# EAGLE design Encoder (EAGLE 9.4.2)

## Sheet 1 of 2: tcrt5000
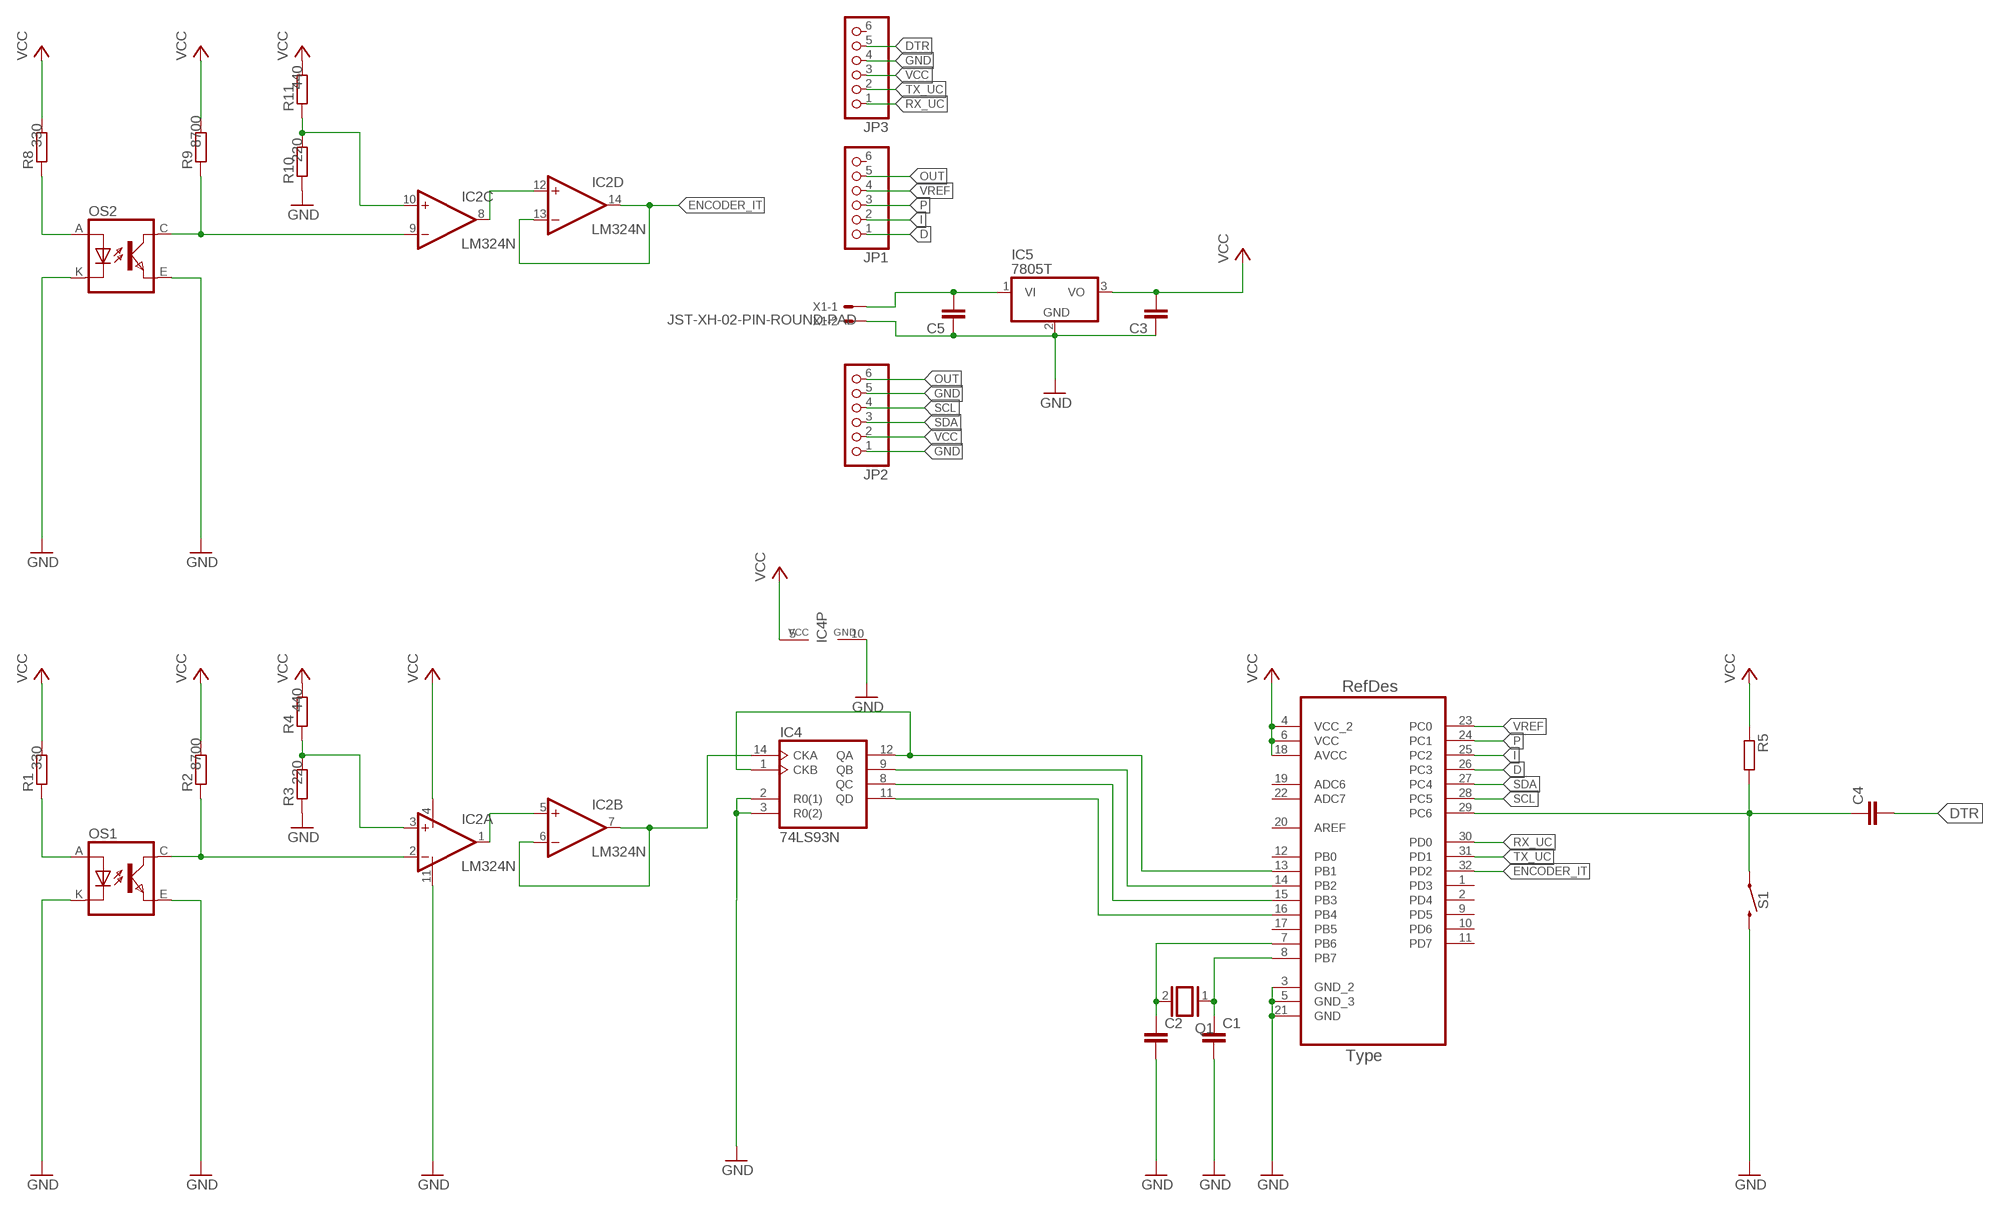
[diagram p0: schematic, sheet 1]

### Parts
C1  C-EUC1206  [C1206]
C2  C-EUC1206  [C1206]
C3  C-EUC1206  [C1206]
C4  C-EUC1206  [C1206]
C5  C-EUC1206  [C1206]
IC2  LM324N  [DIL14]
IC4  74LS93N  [DIL14]
IC5  7805T  [TO220H]
JP1  PINHD-1X6  [1X06]
JP2  PINHD-1X6  [1X06]
JP3  PINHD-1X6  [1X06]
OS1  TCRT5000  [TCRT5000]
OS2  TCRT5000  [TCRT5000]
Q1  XTAL/S  [QS]
R1  R-EU_M1206  [M1206]
R2  R-EU_M1206  [M1206]
R3  R-EU_M1206  [M1206]
R4  R-EU_M1206  [M1206]
R5  R-EU_M1206  [M1206]
R8  R-EU_M1206  [M1206]
R9  R-EU_M1206  [M1206]
R10  R-EU_M1206  [M1206]
R11  R-EU_M1206  [M1206]
S1  MOMENTARY-SWITCH-SPST-PTH-6.0MM  [TACTILE_SWITCH_PTH_6.0MM]
U1  ATMEGA328P-AU  [QFP80P900X900X120-32N]
X1  JST-XH-02-PIN-ROUND-PAD  [JST-XH-02-PACKAGE-ROUND-PAD]

### Nets
D: JP1.1 U1.26(PC3)
DTR: C4.2 JP3.5
ENCODER_IT: IC2.13(D:-IN) IC2.14(D:OUT) U1.32(PD2)
GND: C1.2 C2.2 C3.1 C5.1 IC2.11(P:V-) IC4.2(R0(1)) IC4.3(R0(2)) IC4.10(GND) IC5.2(GND) JP2.1 JP2.5 JP3.4 OS1.E(EMITTER) OS1.K(CATHODE) OS2.E(EMITTER) OS2.K(CATHODE) R3.1 R10.1 S1.3 U1.3(GND_2) U1.5(GND_3) U1.21(GND) X1.2
I: JP1.2 U1.25(PC2)
N$1: OS1.A(ANODE) R1.1
N$2: IC2.2(A:-IN) OS1.C(COLLECTOR) R2.1
N$3: IC2.3(A:+IN) R3.2 R4.1
N$4: IC2.1(A:OUT) IC2.5(B:+IN)
N$5: C1.1 Q1.1 U1.8(PB7)
N$6: C5.2 IC5.1(VI) X1.1
N$7: C2.1 Q1.2 U1.7(PB6)
N$8: C4.1 R5.2 S1.1 U1.29(PC6)
N$9: IC2.6(B:-IN) IC2.7(B:OUT) IC4.14(CKA)
N$10: IC4.1(CKB) IC4.12(QA) U1.13(PB1)
N$11: IC2.8(C:OUT) IC2.12(D:+IN)
N$12: IC4.9(QB) U1.14(PB2)
N$15: OS2.A(ANODE) R8.1
N$16: IC2.9(C:-IN) OS2.C(COLLECTOR) R9.1
N$17: IC2.10(C:+IN) R10.2 R11.1
N$19: IC4.8(QC) U1.15(PB3)
N$20: IC4.11(QD) U1.16(PB4)
OUT: JP1.5 JP2.6
P: JP1.3 U1.24(PC1)
RX_UC: JP3.1 U1.30(PD0)
SCL: JP2.4 U1.28(PC5)
SDA: JP2.3 U1.27(PC4)
TX_UC: JP3.2 U1.31(PD1)
VCC: C3.2 IC2.4(P:V+) IC4.5(VCC) IC5.3(VO) JP2.2 JP3.3 R1.2 R2.2 R4.2 R5.1 R8.2 R9.2 R11.2 U1.4(VCC_2) U1.6(VCC) U1.18(AVCC)
VREF: JP1.4 U1.23(PC0)
Unconnected: JP1.6 JP3.6 U1.1(PD3) U1.2(PD4) U1.9(PD5) U1.10(PD6) U1.11(PD7) U1.12(PB0) U1.17(PB5) U1.19(ADC6) U1.20(AREF) U1.22(ADC7)

## Sheet 2 of 2

## Library data of the parts
C1-C5 = rcl:C-EU: CAPACITOR, European symbol; SPICEPREFIX: C
IC2 = linear:LM324: OP AMP
IC4 = 74xx-eu:74*93: Decade, divide by twelve and binary COUNTER
IC5 = adafruit:78*: Positive VOLTAGE REGULATOR Added bigger pads to the TO-92 package
JP1-JP3 = adafruit:PINHD-1X6: PIN HEADER
OS1 OS2 = tcrt5000:TCRT5000
Q1 = special:XTAL/S: CRYSTAL
R1 R5 R8 = rcl:R-EU_: RESISTOR, European symbol; SPICEPREFIX: 330
R2 R9 = rcl:R-EU_: RESISTOR, European symbol; SPICEPREFIX: 8700
R3 R10 = rcl:R-EU_: RESISTOR, European symbol; SPICEPREFIX: 220
R4 R11 = rcl:R-EU_: RESISTOR, European symbol; SPICEPREFIX: 440
S1 = SparkFun-Switches:MOMENTARY-SWITCH-SPST: Momentary Switch (Pushbutton) - SPST Normally-open (NO) SPST momentary switches (buttons, pushbuttons). Variants PTH-12MM - 12mm square, through-hole Momentary Pushbutton Switch - 12mm Square <https://www.sparkfun.com/products/9190> (COM-09190) PTH-6.0MM, PTH-6.0MM-KIT - 6.0mm square, through-hole Mini Pushbutton Switch <https://www.sparkfun.com/products/97> (COM-00097) KIT package intended for soldering kit's - only one side of pads' copper is exposed. PTH-RIGHT-ANGLE-KIT - Right-angle, through-hole Right Angle Tactile Button <https://www.sparkfun.com/products/10791> - Used on SparkFun BigTime Watch Kit <https://www.sparkfun.com/products/11734> SMD-12MM - 12mm square, surface-mount Tactile Button - SMD (12mm) <https://www.sparkfun.com/products/12993> (COM-12993) Used on SparkFun PicoBoard <https://www.sparkfun.com/products/11888> SMD-4.5MM - 4.5mm Square Trackball Switch Used on SparkFun Blackberry Trackballer Breakout <https://www.sparkfun.com/products/13169> SMD-4.6MMX2.8MM - 4.60mm x 2.80mm, surface mount Used on SparkFun SAMD21 Mini Breakout <https://www.sparkfun.com/products/13664> SMD-5.2MM, SMD-5.2-REDUNDANT - 5.2mm square, surface-mount Mini Pushbutton Switch - SMD <https://www.sparkfun.com/products/8720> (COM-08720) Used on Arduino Pro Mini <https://www.sparkfun.com/products/11114> REDUNDANT package connects both switch circuits together SMD-6.0X3.5MM - 6.0 x 3.5mm, surface mount Momentary Reset Switch SMD <https://www.sparkfun.com/products/8229> (COM-08229) SMD-6.2MM-TALL - 6.2mm square, surface mount Tactile Button - SMD (6mm) <https://www.sparkfun.com/products/12992> Used on SparkFun Digital Sandbox <https://www.sparkfun.com/products/12651> SMD-RIGHT-ANGLE - Right-angle, surface mount Used on SparkFun Block for Intel® Edison - Arduino <https://www.sparkfun.com/products/13036>; PROD_ID: SWCH-08441; SF_SKU: COM-00097
U1 = Atmel-ATMEGA328P-AU:ATMEGA328P-AU; DESCRIPTION: 8-bit Microcontroller with In-System Programmable Flash; MPN: ATMEGA328P-AU; OC_FARNELL: 1715486; OC_NEWARK: 14R4631; PACKAGE: TQFP-32; SUPPLIER: Atmel
X1 = Rembrandt Electronics - JST XH Connectors v1-0:JST-XH-02-PIN: JST XH Connector 2 Pin Wire to board connector. Pitch: 2,54 mm, (0.100") Number of pins: 2 Created by Rembrandt Electronics www.rembrandtelectronics.com

## Board
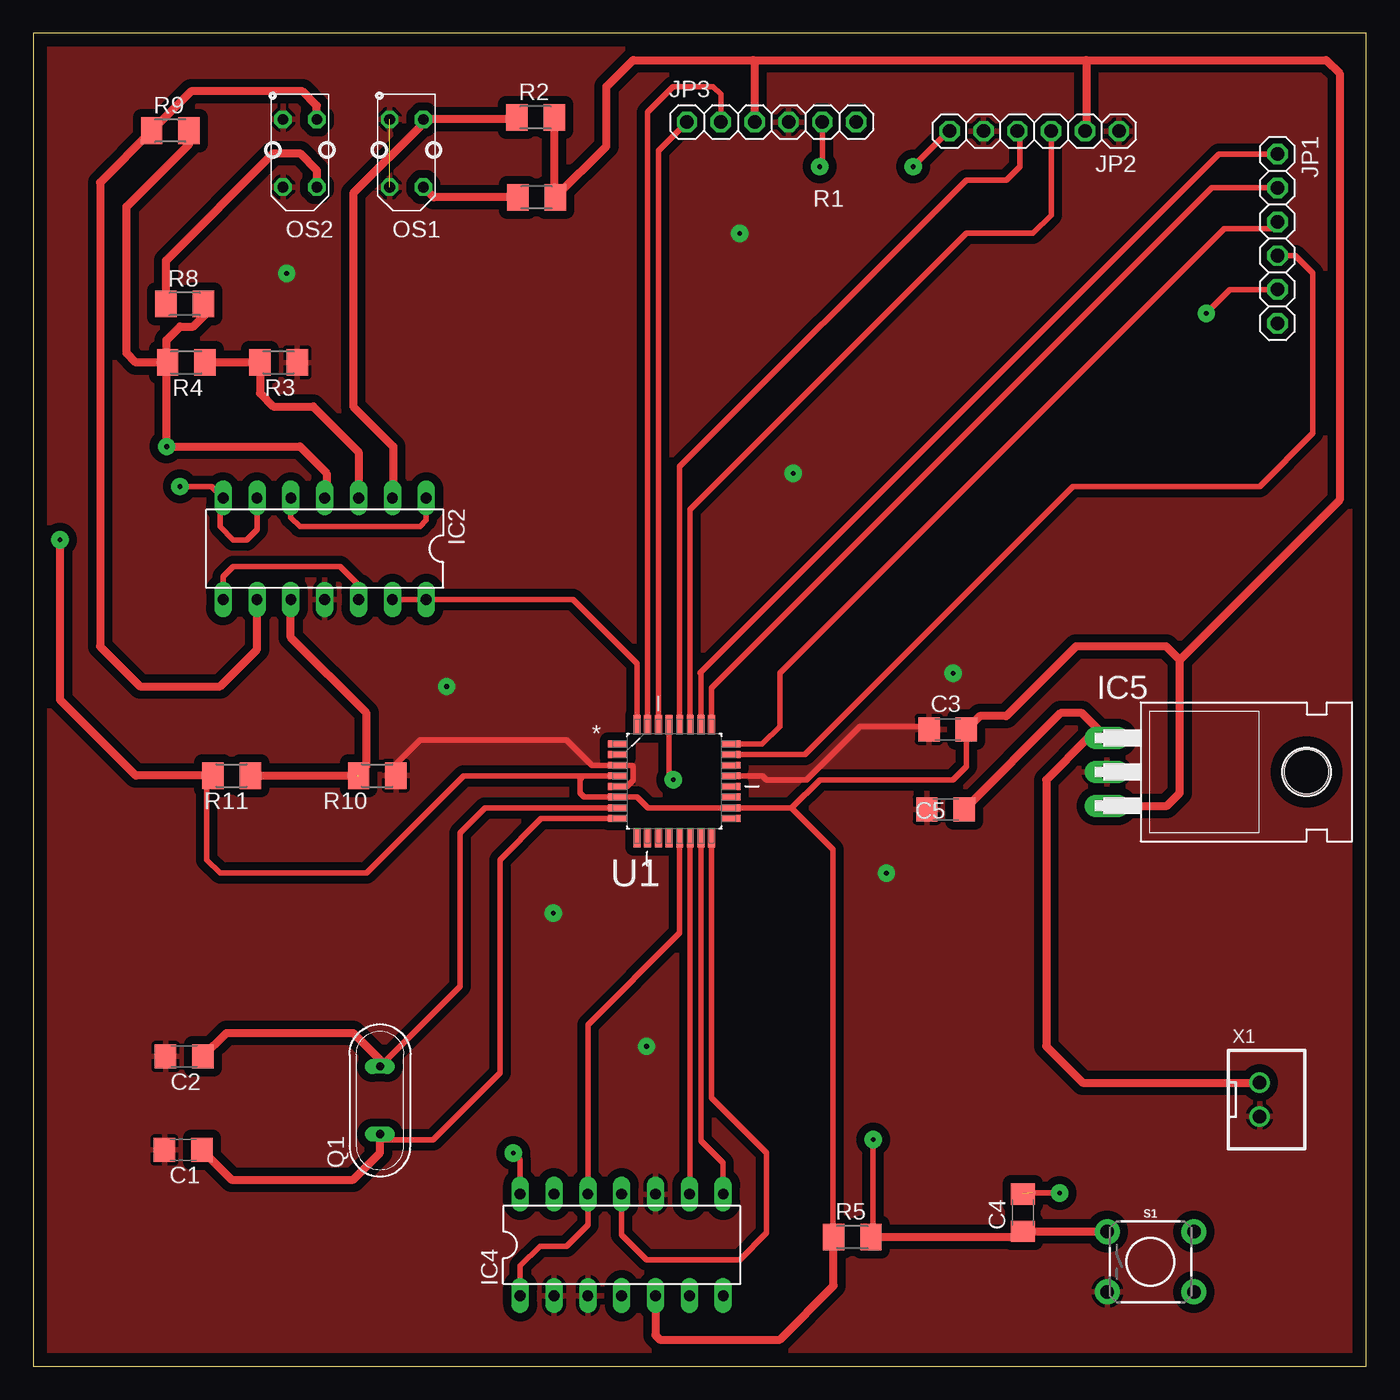
[diagram p1: board, top side]
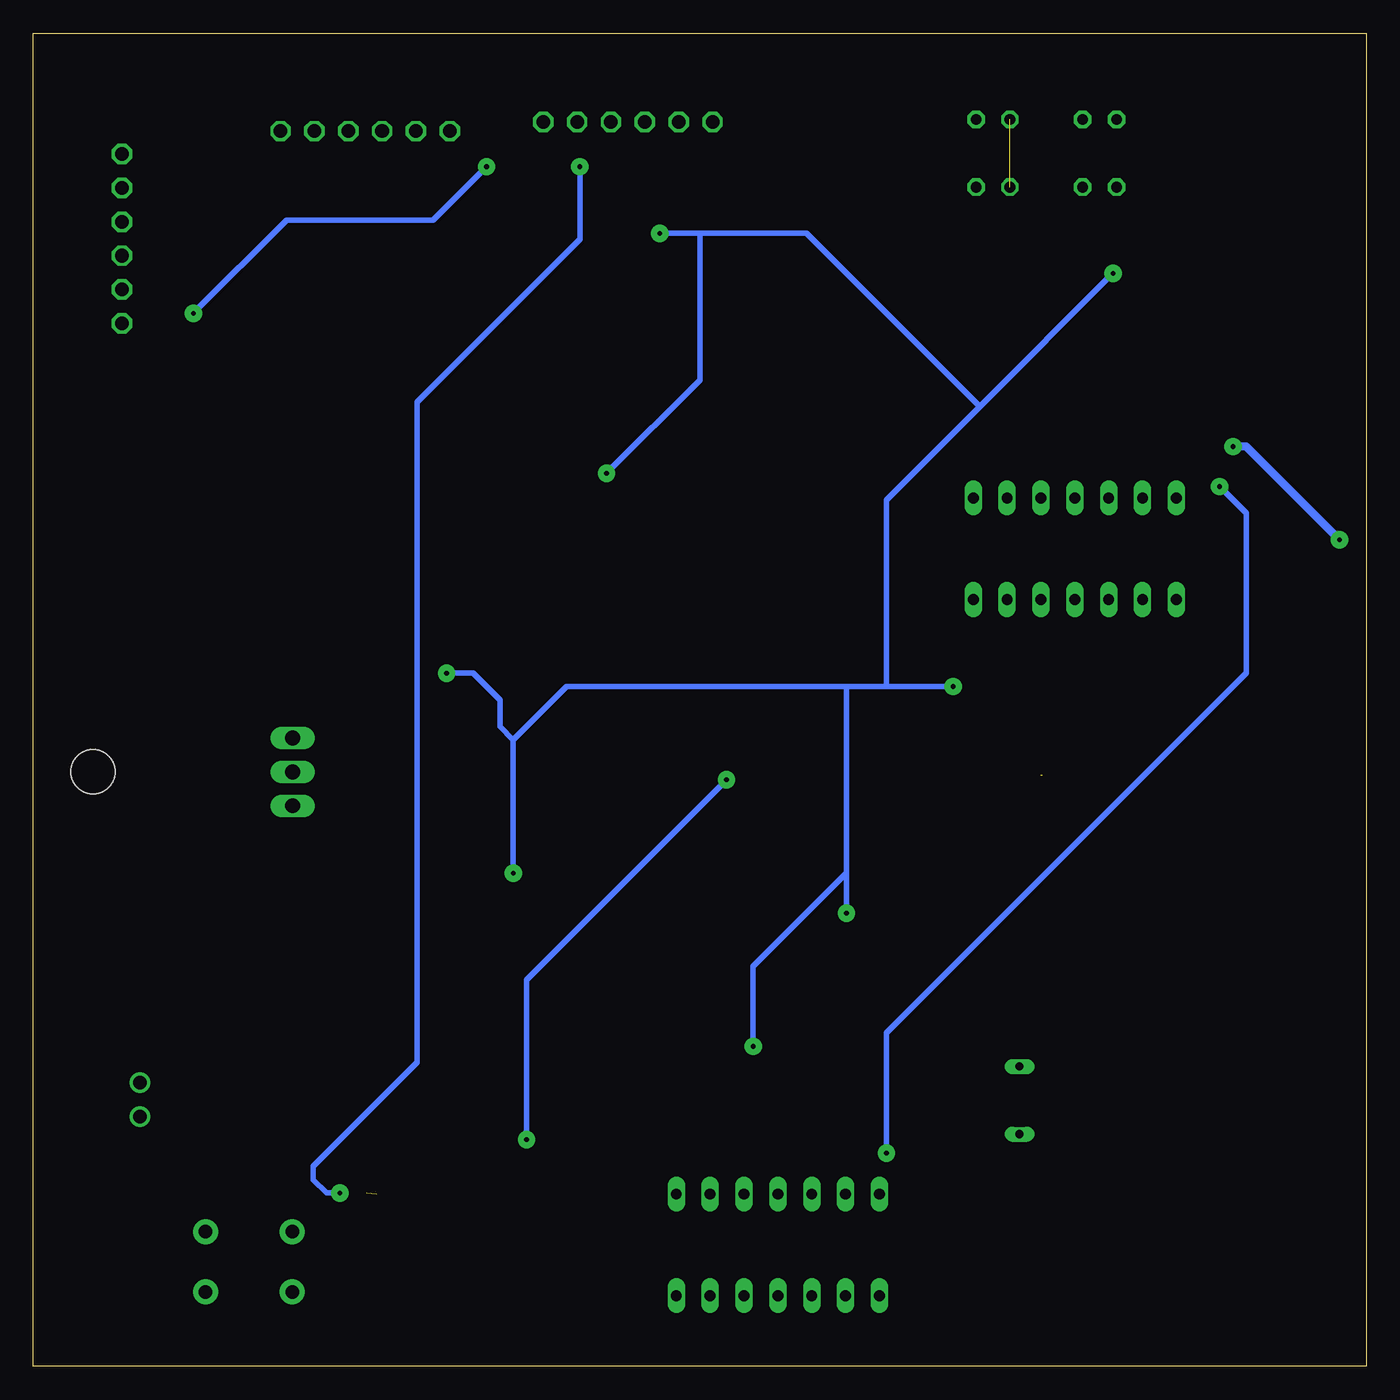
[diagram p2: board, bottom side, seen from below]

Size 100 x 100 mm. Coordinates in mm from the lower left corner, seen from the top.
Outline: 0,0 100,0 100,100 0,100 0,0
Copper layers (1*16): Top 0.035mm / dielectric 1.5mm / Bottom 0.035mm
Design rules "default": minimum track width 6mil, minimum drill 0.35mm, track to track 6mil, track to pad 6mil, pad to pad 6mil, via to via 6mil, smd to smd 6mil, copper to edge 40mil, drill to drill 6mil, minimum pad ring 10mil, minimum via ring 8mil, stop-mask expansion 4mil, vias tented up to drill 0mil, thermal gap 10mil

### Footprints (pad centres in the part's own frame; a part is rotated, then mirrored left to right if it is on the bottom)
C1206 = smd 1.6 x 1.8: 1 -1.4,0; 2 1.4,0
DIL14 = drill 0.813 long: 1 -7.62,-3.81; 2 -5.08,-3.81; 3 -2.54,-3.81; 4 0,-3.81; 5 2.54,-3.81; 6 5.08,-3.81; 7 7.62,-3.81; 8 7.62,3.81; 9 5.08,3.81; 10 2.54,3.81; 11 0,3.81; 12 -2.54,3.81; 13 -5.08,3.81; 14 -7.62,3.81
TO220H = drill 1.118 long: 1 -2.54,-10.16; 2 0,-10.16; 3 2.54,-10.16 | hole 3.302: 0,4.826
1X06 = drill 1.016 octagon: 1 -6.35,0; 2 -3.81,0; 3 -1.27,0; 4 1.27,0; 5 3.81,0; 6 6.35,0
TCRT5000 = drill 0.8 octagon: A -2.54,-1.27; C 2.54,-1.27; E 2.54,1.27; K -2.54,1.27
QS = drill 0.61 long: 1 -2.54,0; 2 2.54,0
M1206 = smd 1.6 x 2: 1 -1.4,0; 2 1.4,0
TACTILE_SWITCH_PTH_6.0MM = drill 1.016 pad 1.88: 1 -3.251,2.261; 2 3.251,2.261; 3 -3.251,-2.261; 4 3.251,-2.261
QFP80P900X900X120-32N = smd 1.473 x 0.508: 1 -4.242,2.794; 2 -4.242,2.007; 3 -4.242,1.194; 4 -4.242,0.406; 5 -4.242,-0.406; 6 -4.242,-1.194; 7 -4.242,-2.007; 8 -4.242,-2.794; 17 4.242,-2.794; 18 4.242,-2.007; 19 4.242,-1.194; 20 4.242,-0.406; 21 4.242,0.406; 22 4.242,1.194; 23 4.242,2.007; 24 4.242,2.794 | smd 0.508 x 1.473: 9 -2.794,-4.242; 10 -2.007,-4.242; 11 -1.194,-4.242; 12 -0.406,-4.242; 13 0.406,-4.242; 14 1.194,-4.242; 15 2.007,-4.242; 16 2.794,-4.242; 25 2.794,4.242; 26 2.007,4.242; 27 1.194,4.242; 28 0.406,4.242; 29 -0.406,4.242; 30 -1.194,4.242; 31 -2.007,4.242; 32 -2.794,4.242
JST-XH-02-PACKAGE-ROUND-PAD = drill 1.016: 1 -1.27,0; 2 1.27,0

### Placement (x,y rotation side)
C1  11.24,16.23 180 top
C2  11.32,23.23 180 top
C3  68.6,47.77 0 top
C4  74.23,11.52 90 top
C5  68.44,41.77 0 top
IC2  21.86,61.33 180 top
IC4  44.14,9.1 0 top
IC5  90.7,44.59 270 top
JP1  93.34,84.59 270 top
JP2  75.1,92.66 180 top
JP3  55.39,93.34 0 top
OS1  28,91 90 top
OS2  20,91 90 top
Q1  26.01,19.95 90 top
R1  37.76,87.69 0 top
R2  37.68,93.69 0 top
R3  18.4,75.31 180 top
R4  11.48,75.31 180 top
R5  61.44,9.69 0 top
R8  11.36,79.69 0 top
R9  10.28,92.69 0 top
R10  25.8,44.31 180 top
R11  14.88,44.31 180 top
S1  83.82,7.83 0 top
U1  48.09,43.89 0 top
X1  92,20 270 top

### Tracks (layer width: path | path; a pad name or v marks a point on that pad's centre or on a via)
D
  Top 0.406: JP1.1 88.94,90.94 50,52 50.1,51.9 U1.26
DTR  (via drill 0.35 pad 1.3)  (1 unrouted)
  Top 0.406: v77,13 75,13 | JP3.5 59.2,90.2 v59,90
  Top 0.61: C4.2 74,13.15
  Bottom 0.406: v59,90 59,84.54 71.2,72.34 71.2,22.8 79,15 79,14 78,13 v77,13
ENCODER_IT
  Top 0.406: U1.32 45.3,52.7 40.48,57.52 IC2.14 IC2.13
GND  (via drill 0.35 pad 1.3)  (1 unrouted)
  Top 0.406: U1.5 44.53,43.48 45,43.95 45,45 44.92,45.08 U1.3 41.92,45.08 40,47 29,47 27.2,45.2 R10.1 | U1.21 54.7,44.3 55,44 58,44 62,48 67,48 67.2,47.8 C3.1
  Bottom 0.406: v31,51 36,51 | 36,51 39,51 | 39,51 60,51 64,47 | 64,47 v64,37 | 64,47 65,48 65,50 67,52 v69,52 | 39,51 39,37 | 39,37 v39,34 | 39,37 46,30 v46,24 | 36,51 36,65 29,72 | 29,72 v19,82 | 29,72 42,85 50,85 | 50,85 v53,85 | 50,85 50,74 v57,67
  pour Top (isolate 0.61): 0,100 0,0 100,0 100,100
I
  Top 0.406: U1.25 50.88,50.88 88.4,88.4 JP1.2
N$1
  Top 0.61: R1.1 30.04,87.69 OS1.A
N$2
  Top 0.61: R2.1 36.13,93.54 OS1.C 29.27,93.27 24,88 24,72 27,69 27,66 26.94,65.94 IC2.2
N$3
  Top 0.61: R4.1 R3.2 17,73 18,72 21,72 24.4,68.6 IC2.3
N$4
  Top 0.406: IC2.1 29.48,63.48 29,63 20,63 19.32,63.68 IC2.5
N$5
  Top 0.406: 26.01,17 30,17 35,22 35,38 38.1,41.1 U1.8
  Top 0.61: C1.1 14.87,14 24,14 26.01,16.01 26.01,17 Q1.1
N$6
  Top 0.61: C5.2 77.07,49 78.67,49 IC5.1 79.13,47.13 76,44 76,24 78.73,21.27 X1.1
N$7
  Top 0.406: Q1.2 32,28.48 32,40 33.88,41.88 U1.7
  Top 0.61: C2.1 14.49,25 24,25 26.26,22.74 Q1.2
N$8  (via drill 0.35 pad 1.3)
  Top 0.406: U1.29 47.68,44.32 v48,44 | v63,17 63,9.85 R5.2
  Top 0.61: C4.1 74.26,10.09 73.86,9.69 R5.2 | 73.8,9.69 C4.1 | C4.1 80.54,10.12 S1.1
  Bottom 0.406: v48,44 63,29 v63,17
N$9  (via drill 0.35 pad 1.3)
  Top 0.406: IC4.14 36.52,15.48 v36,16 | v11,66 13.38,66 IC2.7 14,64.9 14,63 15,62 16,62 16.78,62.78 IC2.6
  Bottom 0.406: v36,16 36,25 9,52 9,64 v11,66
N$10
  Top 0.406: U1.13 48.5,32.5 41.6,25.6 41.6,13 IC4.12 41.6,10.6 40,9 38,9 36.52,7.52 IC4.1
N$11
  Top 0.406: IC2.8 14.24,59.24 15,60 23,60 24.4,58.6 IC2.12
N$12
  Top 0.406: U1.14 49.28,12.97 IC4.9
N$15
  Top 0.61: R8.1 9.96,82.96 18,91 20,91 21.27,89.73 OS2.A
N$16
  Top 0.61: OS2.C 21.27,94.57 20.19,95.65 11.84,95.65 R9.1 5,88.81 5,54 8,51 14,51 16.78,53.78 IC2.9
N$17  (1 unrouted)
  Top 0.61: R11.1 24.31,44.31 25,45 25,49 19.32,54.68 IC2.10
N$19
  Top 0.406: IC4.8 51.76,15.24 50.1,16.9 U1.15
N$20
  Top 0.406: U1.16 50.88,20.12 55,16 55,10 53,8 46,8 44.14,9.86 IC4.11
OUT  (via drill 0.35 pad 1.3)
  Top 0.406: JP2.6 68.66,92.66 v66,90 | v88,79 89.78,80.78 JP1.5
  Bottom 0.406: v66,90 70,86 81,86 v88,79
P
  Top 0.406: 52.68,46.68 U1.24 54.68,46.68 56,48 56,52 89.34,85.34 92.82,85.34 JP1.3
RX_UC
  Top 0.406: U1.30 46.9,91.2 JP3.1
SCL
  Top 0.406: U1.28 48.5,67.5 70,89 73,89 74,90 74,92.49 JP2.4
SDA
  Top 0.406: U1.27 49.28,64.28 70,85 75,85 76.37,86.37 JP2.3
TX_UC
  Top 0.406: U1.31 46.08,94.08 48,96 51,96 51.58,95.42 JP3.2
VCC  (via drill 0.35 pad 1.3)
  Top 0.406: 56.88,41.88 U1.18 46.12,41.88 45.3,42.7 U1.6 41.3,42.7 41,43 41,44 41.3,44.3 | C3.2 70,45 69,44 59,44 56.88,41.88 | U1.4 41.3,44.3 | 41.3,44.3 32.3,44.3 25,37 14,37 13,38 13,44.31 | 56.88,41.88 60,38.77 60,9.73 R5.1
  Top 0.61: IC4.5 46.68,2.32 47,2 56,2 60.04,6.04 R5.1 | IC5.3 85.05,42.05 86,43 86,53 | 86,53 85,54 78.23,54 73,48.77 71,48.77 C3.2 | R11.2 13,44.31 7.69,44.31 2,50 v2,62 | IC2.4 22,65.28 22,67 20,69 v10,69 10,75.23 R4.2 | R4.2 10,75.39 10,77 11,78 12,78 13,79 13,79.45 R8.2 | R4.2 7.69,75.31 7,76 7,87 11.68,91.68 R9.2 | R2.2 39.08,87.77 R1.2 43,91.53 43,96 45,98 54,98 | 54,98 54.12,97.88 JP3.3 | 54,98 79,98 | 79,98 79,92.75 JP2.2 | 79,98 97,98 98,97 98,65 86,53
  Bottom 0.61: v2,62 9,69 v10,69
VREF
  Top 0.406: U1.23 57.9,45.9 78,66 92,66 96,70 96,82 94.68,83.32 JP1.4